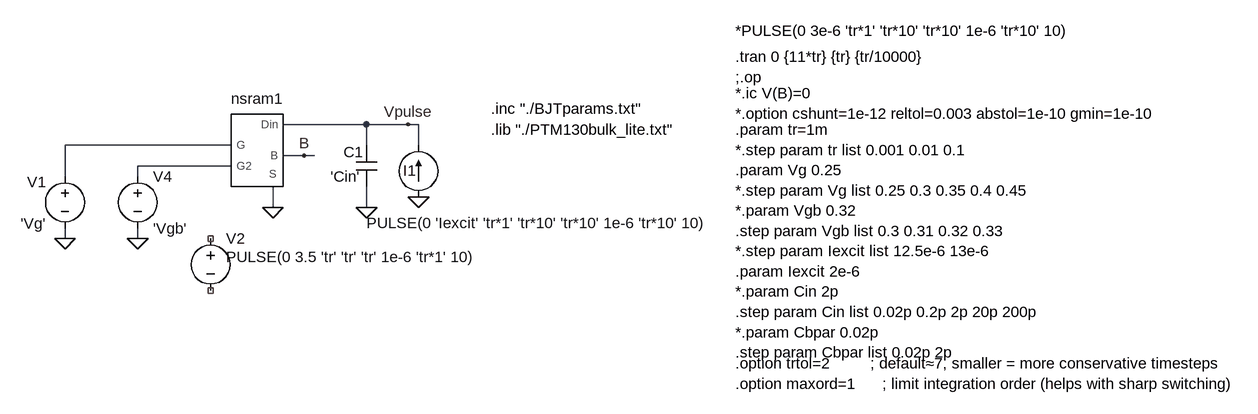
[diagram p0: schematic adaptiveSpiking.asc]
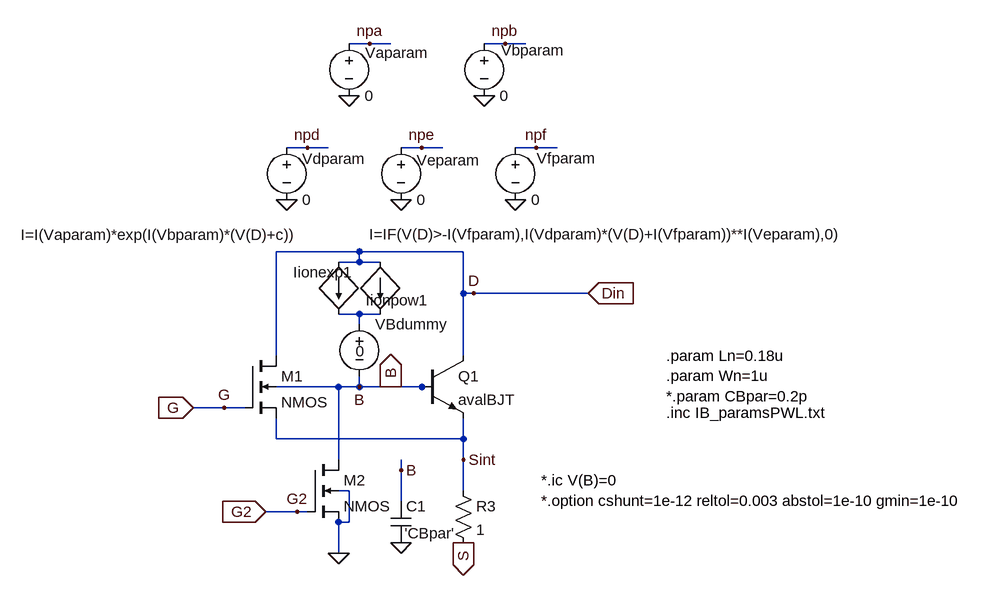
[diagram p1: sub-circuit 2tnsram.asc]
adaptiveSpiking.asc, the LTspice schematic file:
Version 4
SHEET 1 2588 680
WIRE 672 128 544 128
WIRE 736 128 672 128
WIRE 752 128 736 128
WIRE 464 160 208 160
WIRE 672 160 672 128
WIRE 752 160 752 128
WIRE 576 176 544 176
WIRE 592 176 576 176
WIRE 464 192 320 192
WIRE 208 208 208 160
WIRE 320 208 320 192
WIRE 528 256 528 224
WIRE 672 256 672 224
WIRE 208 304 208 288
WIRE 320 304 320 288
FLAG 208 304 0
FLAG 736 128 Vpulse
FLAG 752 240 0
FLAG 320 304 0
FLAG 528 256 0
FLAG 576 176 B
FLAG 672 256 0
SYMBOL voltage 208 192 R0
WINDOW 123 0 0 Left 0
WINDOW 39 0 0 Left 0
WINDOW 0 -58 25 Left 2
WINDOW 3 -68 89 Left 2
SYMATTR InstName V1
SYMATTR Value 'Vg'
SYMBOL voltage 320 192 R0
WINDOW 123 0 0 Left 0
WINDOW 39 0 0 Left 0
SYMATTR InstName V4
SYMATTR Value 'Vgb'
SYMBOL 2TNSRAM 496 160 R0
SYMATTR InstName nsram1
SYMBOL current 752 240 R180
WINDOW 0 3 41 Left 2
WINDOW 3 -443 -40 Left 2
WINDOW 123 0 0 Left 0
WINDOW 39 0 0 Left 0
SYMATTR InstName I1
SYMATTR Value PULSE(0 'Iexcit' 'tr*1' 'tr*10' 'tr*10' 1e-6 'tr*10' 10)
SYMBOL voltage 432 288 R0
WINDOW 3 24 44 Left 2
SYMATTR Value PULSE(0 3.5 'tr' 'tr' 'tr' 1e-6 'tr*1' 10)
SYMATTR InstName V2
SYMBOL cap 656 160 R0
WINDOW 3 -39 48 Left 2
WINDOW 0 -19 11 Left 2
SYMATTR Value 'Cin'
SYMATTR InstName C1
TEXT 1240 24 Left 2 !.tran 0 {11*tr} {tr} {tr/10000}\n;.op
TEXT 1240 136 Left 2 !.param tr=1m\n*.step param tr list 0.001 0.01 0.1\n.param Vg 0.25\n*.step param Vg list 0.25 0.3 0.35 0.4 0.45\n*.param Vgb 0.32\n.step param Vgb list 0.3 0.31 0.32 0.33\n*.step param Iexcit list 12.5e-6 13e-6\n.param Iexcit 2e-6\n*.param Cin 2p\n.step param Cin list 0.02p 0.2p 2p 20p 200p\n*.param Cbpar 0.02p\n.step param Cbpar list 0.02p 2p
TEXT 1240 80 Left 2 !*.ic V(B)=0\n*.option cshunt=1e-12 reltol=0.003 abstol=1e-10 gmin=1e-10
TEXT 864 136 Left 2 !.lib "./PTM130bulk_lite.txt"
TEXT 864 104 Left 2 !.inc "./BJTparams.txt"
TEXT 1240 -16 Left 2 !*PULSE(0 3e-6 'tr*1' 'tr*10' 'tr*10' 1e-6 'tr*10' 10)
TEXT 1240 496 Left 2 !.option trtol=2         ; default≈7, smaller = more conservative timesteps\n.option maxord=1      ; limit integration order (helps with sharp switching)

2tnsram.asc, the sub-circuit schematic file:
Version 4
SHEET 1 3052 680
WIRE 656 -368 624 -368
WIRE 688 -368 656 -368
WIRE 864 -368 832 -368
WIRE 896 -368 864 -368
WIRE 560 -208 528 -208
WIRE 592 -208 560 -208
WIRE 736 -208 704 -208
WIRE 768 -208 736 -208
WIRE 912 -208 880 -208
WIRE 944 -208 912 -208
WIRE 640 -48 512 -48
WIRE 800 -48 640 -48
WIRE 640 -32 640 -48
WIRE 640 -32 608 -32
WIRE 672 -32 640 -32
WIRE 800 16 800 -48
WIRE 816 16 800 16
WIRE 992 16 816 16
WIRE 640 48 608 48
WIRE 672 48 640 48
WIRE 640 64 640 48
WIRE 512 112 512 -48
WIRE 800 112 800 16
WIRE 608 160 512 160
WIRE 640 160 640 144
WIRE 640 160 608 160
WIRE 688 160 640 160
WIRE 736 160 688 160
WIRE 752 160 736 160
WIRE 432 192 384 192
WIRE 464 192 432 192
WIRE 512 240 512 208
WIRE 800 240 800 208
WIRE 800 240 512 240
WIRE 608 272 608 160
WIRE 800 272 800 240
WIRE 704 288 704 272
WIRE 624 320 608 320
WIRE 800 320 800 272
WIRE 704 336 704 288
WIRE 544 352 496 352
WIRE 560 352 544 352
WIRE 624 368 624 320
WIRE 624 368 608 368
WIRE 608 416 608 368
FLAG 640 160 B
FLAG 800 272 Sint
FLAG 816 16 D
FLAG 704 400 0
FLAG 704 288 B
FLAG 608 416 0
FLAG 432 192 G
FLAG 544 352 G2
FLAG 624 -288 0
FLAG 656 -368 npa
FLAG 832 -288 0
FLAG 864 -368 npb
FLAG 528 -128 0
FLAG 560 -208 npd
FLAG 704 -128 0
FLAG 736 -208 npe
FLAG 880 -128 0
FLAG 912 -208 npf
FLAG 384 192 G
IOPIN 384 192 In
FLAG 496 352 G2
IOPIN 496 352 In
FLAG 992 16 Din
IOPIN 992 16 In
FLAG 800 400 S
IOPIN 800 400 Out
FLAG 688 160 B
IOPIN 688 160 Out
SYMBOL npn 736 112 R0
SYMATTR InstName Q1
SYMATTR Value avalBJT
SYMATTR Value2 area=AreaPar
SYMBOL res 784 304 R0
SYMATTR InstName R3
SYMATTR Value 1
SYMBOL nmos4 464 112 R0
SYMATTR InstName M1
SYMATTR Value2 l='Ln' w='Wn' m=1
SYMBOL cap 688 336 R0
WINDOW 3 22 49 Left 2
SYMATTR Value 'CBpar'
SYMATTR InstName C1
SYMATTR SpiceLine Rser=1m
SYMBOL nmos4 560 272 R0
SYMATTR InstName M2
SYMATTR Value2 l='Ln*10' w='Wn' m=1
SYMBOL bi 608 -32 R0
WINDOW 3 -489 -42 Left 2
WINDOW 0 -70 16 Left 2
SYMATTR Value I=I(Vaparam)*exp(I(Vbparam)*(V(D)+c))
SYMATTR InstName Iionexp1
SYMBOL bi 672 -32 R0
WINDOW 3 -17 -43 Left 2
WINDOW 0 -22 59 Left 2
SYMATTR Value I=IF(V(D)>-I(Vfparam),I(Vdparam)*(V(D)+I(Vfparam))**I(Veparam),0)
SYMATTR InstName Iionpow1
SYMBOL voltage 624 -384 R0
WINDOW 0 25 30 Left 2
SYMATTR InstName Vaparam
SYMATTR Value 0
SYMATTR Prefix ""
SYMBOL voltage 832 -384 R0
WINDOW 0 26 26 Left 2
SYMATTR InstName Vbparam
SYMATTR Value 0
SYMATTR Prefix ""
SYMBOL voltage 528 -224 R0
WINDOW 0 24 33 Left 2
SYMATTR InstName Vdparam
SYMATTR Value 0
SYMATTR Prefix ""
SYMBOL voltage 704 -224 R0
WINDOW 0 24 35 Left 2
SYMATTR InstName Veparam
SYMATTR Value 0
SYMATTR Prefix ""
SYMBOL voltage 880 -224 R0
WINDOW 0 33 32 Left 2
SYMATTR InstName Vfparam
SYMATTR Value 0
SYMATTR Prefix ""
SYMBOL voltage 640 48 R0
WINDOW 3 -6 57 Left 2
SYMATTR Value 0
SYMATTR InstName VBdummy
SYMATTR Prefix ""
TEXT 1112 112 Left 2 !.param Ln=0.18u\n.param Wn=1u\n*.param CBpar=0.2p
TEXT 920 304 Left 2 !*.ic V(B)=0\n*.option cshunt=1e-12 reltol=0.003 abstol=1e-10 gmin=1e-10
TEXT 1112 200 Left 2 !.inc IB_paramsPWL.txt

The netlist it stands for:
* adaptiveSpiking.asc
V1 N001 0 'Vg'
V4 N002 0 'Vgb'
Xnsram1 Vpulse N001 N002 0 B 2tnsram
I1 0 Vpulse PULSE(0 'Iexcit' 'tr*1' 'tr*10' 'tr*10' 1e-6 'tr*10' 10)
V2 NC_01 NC_02 PULSE(0 3.5 'tr' 'tr' 'tr' 1e-6 'tr*1' 10)
C1 Vpulse 0 'Cin'

* block symbol definitions
.subckt 2tnsram Din G G2 S B
Q1 Din B Sint 0 avalBJT area=AreaPar
R3 Sint S 1
M1 Din G Sint B NMOS l='Ln' w='Wn' m=1
C1 B 0 'CBpar' Rser=1m
M2 B G2 0 0 NMOS l='Ln*10' w='Wn' m=1
B§Iionexp1 Din N001 I=I(Vaparam)*exp(I(Vbparam)*(V(D)+c))
B§Iionpow1 Din N001 I=IF(V(D)>-I(Vfparam),I(Vdparam)*(V(D)+I(Vfparam))**I(Veparam),0)
XVaparam npa 0 0  ; pins + -
XVbparam npb 0 0  ; pins + -
XVdparam npd 0 0  ; pins + -
XVeparam npe 0 0  ; pins + -
XVfparam npf 0 0  ; pins + -
XVBdummy N001 B 0  ; pins + -
.param Ln=0.18u
.param Wn=1u
*.param CBpar=0.2p
*.ic V(B)=0
*.option cshunt=1e-12 reltol=0.003 abstol=1e-10 gmin=1e-10
.inc IB_paramsPWL.txt
.ends 2tnsram

.model NPN NPN
.model PNP PNP
.lib standard.bjt
.model NMOS NMOS
.model PMOS PMOS
.lib standard.mos
.tran 0 {11*tr} {tr} {tr/10000}
;.op
.param tr=1m
*.step param tr list 0.001 0.01 0.1
.param Vg 0.25
*.step param Vg list 0.25 0.3 0.35 0.4 0.45
*.param Vgb 0.32
.step param Vgb list 0.3 0.31 0.32 0.33
*.step param Iexcit list 12.5e-6 13e-6
.param Iexcit 2e-6
*.param Cin 2p
.step param Cin list 0.02p 0.2p 2p 20p 200p
*.param Cbpar 0.02p
.step param Cbpar list 0.02p 2p
*.ic V(B)=0
*.option cshunt=1e-12 reltol=0.003 abstol=1e-10 gmin=1e-10
.lib "./PTM130bulk_lite.txt"
.inc "./BJTparams.txt"
*PULSE(0 3e-6 'tr*1' 'tr*10' 'tr*10' 1e-6 'tr*10' 10)
.option trtol=2         ; default≈7, smaller = more conservative timesteps
.option maxord=1      ; limit integration order (helps with sharp switching)
.backanno
.end